# EAGLE design OSHWA Badges_7 (EAGLE 7.7.0)
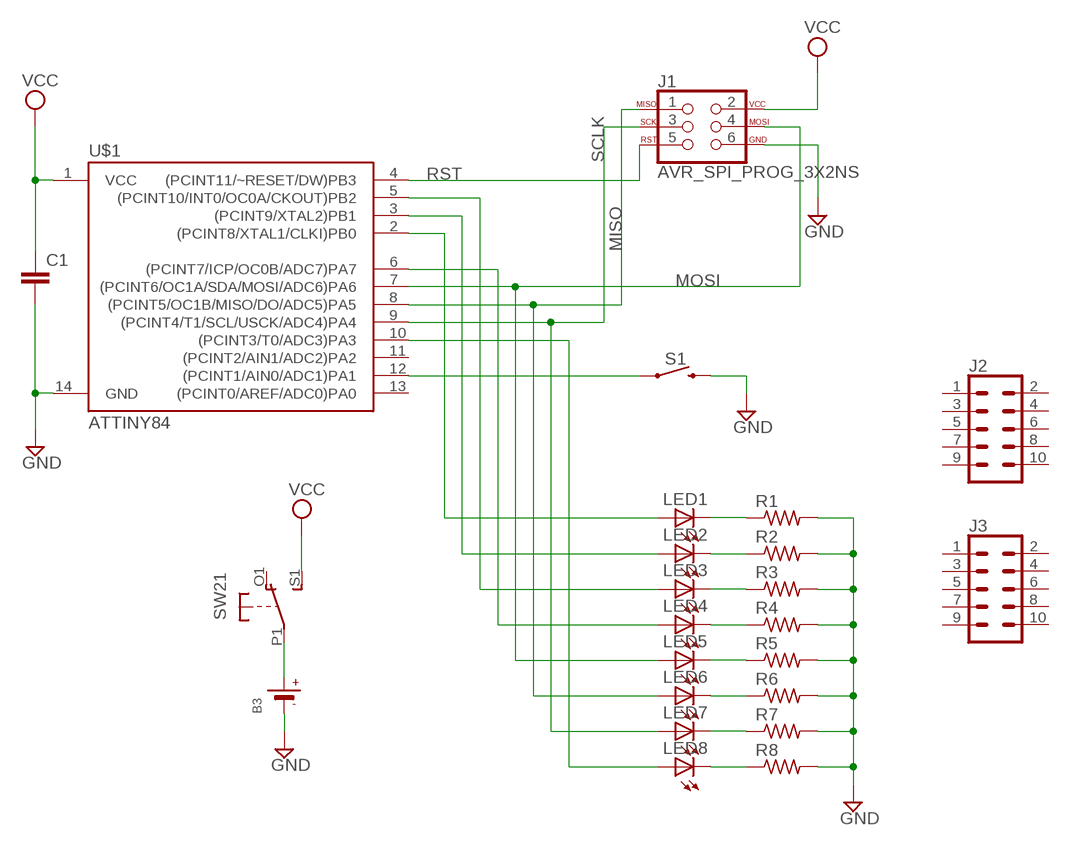
[diagram p0: schematic, sheet 1]

## Parts
B3  BATTERYCR2032_BAT-HLD-001  [CR2032_SMT_BAT-HLD-001]
C1  C-EUC0805K  [C0805K]
J1  AVR_SPI_PROG_3X2NS  [2X3-NS]
J2  CONN_05X2NO_SILK  [2X5_NOSILK]
J3  CONN_05X2NO_SILK  [2X5_NOSILK]
LED1  LEDCHIPLED_0805  [CHIPLED_0805]
LED2  LEDCHIPLED_0805  [CHIPLED_0805]
LED3  LEDCHIPLED_0805  [CHIPLED_0805]
LED4  LEDCHIPLED_0805  [CHIPLED_0805]
LED5  LEDCHIPLED_0805  [CHIPLED_0805]
LED6  LEDCHIPLED_0805  [CHIPLED_0805]
LED7  LEDCHIPLED_0805  [CHIPLED_0805]
LED8  LEDCHIPLED_0805  [CHIPLED_0805]
R1  R-US_M0805  [M0805]
R2  R-US_M0805  [M0805]
R3  R-US_M0805  [M0805]
R4  R-US_M0805  [M0805]
R5  R-US_M0805  [M0805]
R6  R-US_M0805  [M0805]
R7  R-US_M0805  [M0805]
R8  R-US_M0805  [M0805]
S1  MOMENTARY-SWITCH-SPST-PTH-6.0MM-KIT  [TACTILE_SWITCH_PTH_6.0MM_KIT]
SW2  DPDT-EG1390  [EG1390]
U$1  ATTINY84  [SO14]

## Nets
GND: B3.- C1.2 J1.6 R1.2 R2.2 R3.2 R4.2 R5.2 R6.2 R7.2 R8.2 S1.3 U$1.14(GND)
MISO: J1.1 LED6.A U$1.8((PCINT5/OC1B/MISO/DO/ADC5)PA5)
MOSI: J1.4 LED5.A U$1.7((PCINT6/OC1A/SDA/MOSI/ADC6)PA6)
N$3: LED1.C R1.1
N$6: LED2.C R2.1
N$7: LED3.C R3.1
N$8: LED4.C R4.1
N$9: LED5.C R5.1
N$10: LED6.C R6.1
N$11: LED7.C R7.1
N$12: LED8.C R8.1
N$13: LED1.A U$1.2((PCINT8/XTAL1/CLKI)PB0)
N$14: LED2.A U$1.3((PCINT9/XTAL2)PB1)
N$15: LED3.A U$1.5((PCINT10/INT0/OC0A/CKOUT)PB2)
N$16: LED4.A U$1.6((PCINT7/ICP/OC0B/ADC7)PA7)
N$17: LED8.A U$1.10((PCINT3/T0/ADC3)PA3)
N$19: B3.+$1(+) B3.+$2(+) SW2.P1(1:P)
N$23: S1.1 U$1.12((PCINT1/AIN0/ADC1)PA1)
RST: J1.5 U$1.4((PCINT11/~RESET/DW)PB3)
SCLK: J1.3 LED7.A U$1.9((PCINT4/T1/SCL/USCK/ADC4)PA4)
VCC: C1.1 J1.2 SW2.S1(1:S) U$1.1(VCC)
Unconnected: J2.1 J2.2 J2.3 J2.4 J2.5 J2.6 J2.7 J2.8 J2.9 J2.10 J3.1 J3.2 J3.3 J3.4 J3.5 J3.6 J3.7 J3.8 J3.9 J3.10 SW2.O1(1:O) SW2.O2(2:O) SW2.P2(2:P) SW2.S2(2:S) U$1.11((PCINT2/AIN1/ADC2)PA2) U$1.13((PCINT0/AREF/ADC0)PA0)

## Library data of the parts
B3 = microbuilder:BATTERY: CR1220 SMT - Digikey: 3001K-ND CD2032 BAT-HLD-001 - Digikey: BAT-HLD-001-ND
C1 = rcl:C-EU: CAPACITOR, European symbol
J1 = SparkFun-Connectors:AVR_SPI_PROG_3X2: AVR ISP 6 Pin This is the reduced ISP connector for AVR programming. Common on Arduino. This footprint will take up less PCB space and can be used with a 10-pin to 6-pin adapter such as SKU: BOB-08508 **Special note about "TEST_POINT" package. The stop mask is on the top side, so if you want your programming test points to be on the bottom of your board, make sure to place this package on the bottom side of the board. This also ensure that the orientation to program from the bottom side will be correct. SparkFun Products: SparkFun ISP Pogo Adapter <https://www.sparkfun.com/products/11591> - NS Tiny AVR Programmer <https://www.sparkfun.com/products/11801> -PTH
J2 J3 = SparkFun-Connectors:CONN_05X2: Multi connection point. Often used as Generic Header-pin footprint for 0.1 inch spaced/style header connections For AVR SPI programming port, see special device with nice symbol: "AVR_SPI_PROG_5x2.dev" You can populate with any combo of single row headers, but if you'd like an exact match, check these: 2x5 AVR ICSP Male Header <https://www.sparkfun.com/products/778> (PRT-00778) 2x5 Pin Shrouded Header <https://www.sparkfun.com/products/8506> (PRT-08506) On any of the 0.1 inch spaced packages, you can populate with these: Break Away Headers - Straight <https://www.sparkfun.com/products/116> (PRT-00116) Break Away Male Headers - Right Angle <https://www.sparkfun.com/products/553> (PRT-00553) Female Headers <https://www.sparkfun.com/products/115> (PRT-00115) Break Away Headers - Machine Pin <https://www.sparkfun.com/products/117> (PRT-00117) Break Away Female Headers - Swiss Machine Pin <https://www.sparkfun.com/products/743> (PRT-00743) Special note: the shrouded connector mates well with our 5x2 ribbon cables: 2x5 Pin IDC Ribbon Cable <https://www.sparkfun.com/products/8535> (PRT-08535)
LED1-LED8 = adafruit:LED: LED OSRAM: - CHIPLED LG R971, LG N971, LY N971, LG Q971, LY Q971, LO R971, LY R971 LH N974, LH R974 LS Q976, LO Q976, LY Q976 LO Q996 - Hyper CHIPLED LW Q18S LB Q993, LB Q99A, LB R99A - SideLED LS A670, LO A670, LY A670, LG A670, LP A670 LB A673, LV A673, LT A673, LW A673 LH A674 LY A675 LS A676, LA A676, LO A676, LY A676, LW A676 LS A679, LY A679, LG A679 - Hyper Micro SIDELED® LS Y876, LA Y876, LO Y876, LY Y876 LT Y87S - SmartLED LW L88C, LW L88S LB L89C, LB L89S, LG L890 LS L89K, LO L89K, LY L89K LS L896, LA L896, LO L896, LY L896 - TOPLED LS T670, LO T670, LY T670, LG T670, LP T670 LSG T670, LSP T670, LSY T670, LOP T670, LYG T670 LG T671, LOG T671, LSG T671 LB T673, LV T673, LT T673, LW T673 LH T674 LS T676, LA T676, LO T676, LY T676, LB T676, LH T676, LSB T676, LW T676 LB T67C, LV T67C, LT T67C, LS T67K, LO T67K, LY T67K, LW E67C LS E67B, LA E67B, LO E67B, LY E67B, LB E67C, LV E67C, LT E67C LW T67C LS T679, LY T679, LG T679 LS T770, LO T770, LY T770, LG T770, LP T770 LB T773, LV T773, LT T773, LW T773 LH T774 LS E675, LA E675, LY E675, LS T675 LS T776, LA T776, LO T776, LY T776, LB T776 LHGB T686 LT T68C, LB T68C - Hyper Mini TOPLED® LB M676 - Mini TOPLED Santana® LG M470 LS M47K, LO M47K, LY M47K Source: http://www.osram.convergy.de/
R1-R8 = rcl:R-US_: RESISTOR, American symbol
S1 = SparkFun-Switches:MOMENTARY-SWITCH-SPST: Momentary Switch (Pushbutton) - SPST Normally-open (NO) SPST momentary switches (buttons, pushbuttons). Variants PTH-12MM - 12mm square, through-hole Momentary Pushbutton Switch - 12mm Square <https://www.sparkfun.com/products/9190> (COM-09190) PTH-6.0MM, PTH-6.0MM-KIT - 6.0mm square, through-hole Mini Pushbutton Switch <https://www.sparkfun.com/products/97> (COM-00097) KIT package intended for soldering kit's - only one side of pads' copper is exposed. PTH-RIGHT-ANGLE-KIT - Right-angle, through-hole Right Angle Tactile Button <https://www.sparkfun.com/products/10791> - Used on SparkFun BigTime Watch Kit <https://www.sparkfun.com/products/11734> SMD-12MM - 12mm square, surface-mount Tactile Button - SMD (12mm) <https://www.sparkfun.com/products/12993> (COM-12993) Used on SparkFun PicoBoard <https://www.sparkfun.com/products/11888> SMD-4.5MM - 4.5mm Square Trackball Switch Used on SparkFun Blackberry Trackballer Breakout <https://www.sparkfun.com/products/13169> SMD-4.6MMX2.8MM - 4.60mm x 2.80mm, surface mount Used on SparkFun SAMD21 Mini Breakout <https://www.sparkfun.com/products/13664> SMD-5.2MM, SMD-5.2-REDUNDANT - 5.2mm square, surface-mount Mini Pushbutton Switch - SMD <https://www.sparkfun.com/products/8720> (COM-08720) Used on Arduino Pro Mini <https://www.sparkfun.com/products/11114> REDUNDANT package connects both switch circuits together SMD-6.0X3.5MM - 6.0 x 3.5mm, surface mount Momentary Reset Switch SMD <https://www.sparkfun.com/products/8229> (COM-08229) SMD-6.2MM-TALL - 6.2mm square, surface mount Tactile Button - SMD (6mm) <https://www.sparkfun.com/products/12992> Used on SparkFun Digital Sandbox <https://www.sparkfun.com/products/12651> SMD-RIGHT-ANGLE - Right-angle, surface mount Used on SparkFun Block for Intel® Edison - Arduino <https://www.sparkfun.com/products/13036>; PROD_ID: SWCH-08441; SF_SKU: COM-00097
SW2 = adafruit:DPDT
U$1 = SparkFun-IC-Microcontroller:ATTINY84: Atmel 14-pin 2/4/8kB flash uC Datasheet <https://cdn.sparkfun.com/datasheets/Widgets/doc8006.pdf> SparkFun Products Tiny AVR Programmer <https://www.sparkfun.com/products/11801> (PGM-11801) SparkFun Servo Trigger - Continuous Rotation <https://www.sparkfun.com/products/13872> (WIG-13872) SparkFun Servo Trigger <https://www.sparkfun.com/products/13118> (WIG-13118); PROD_ID: IC-11285

## Board
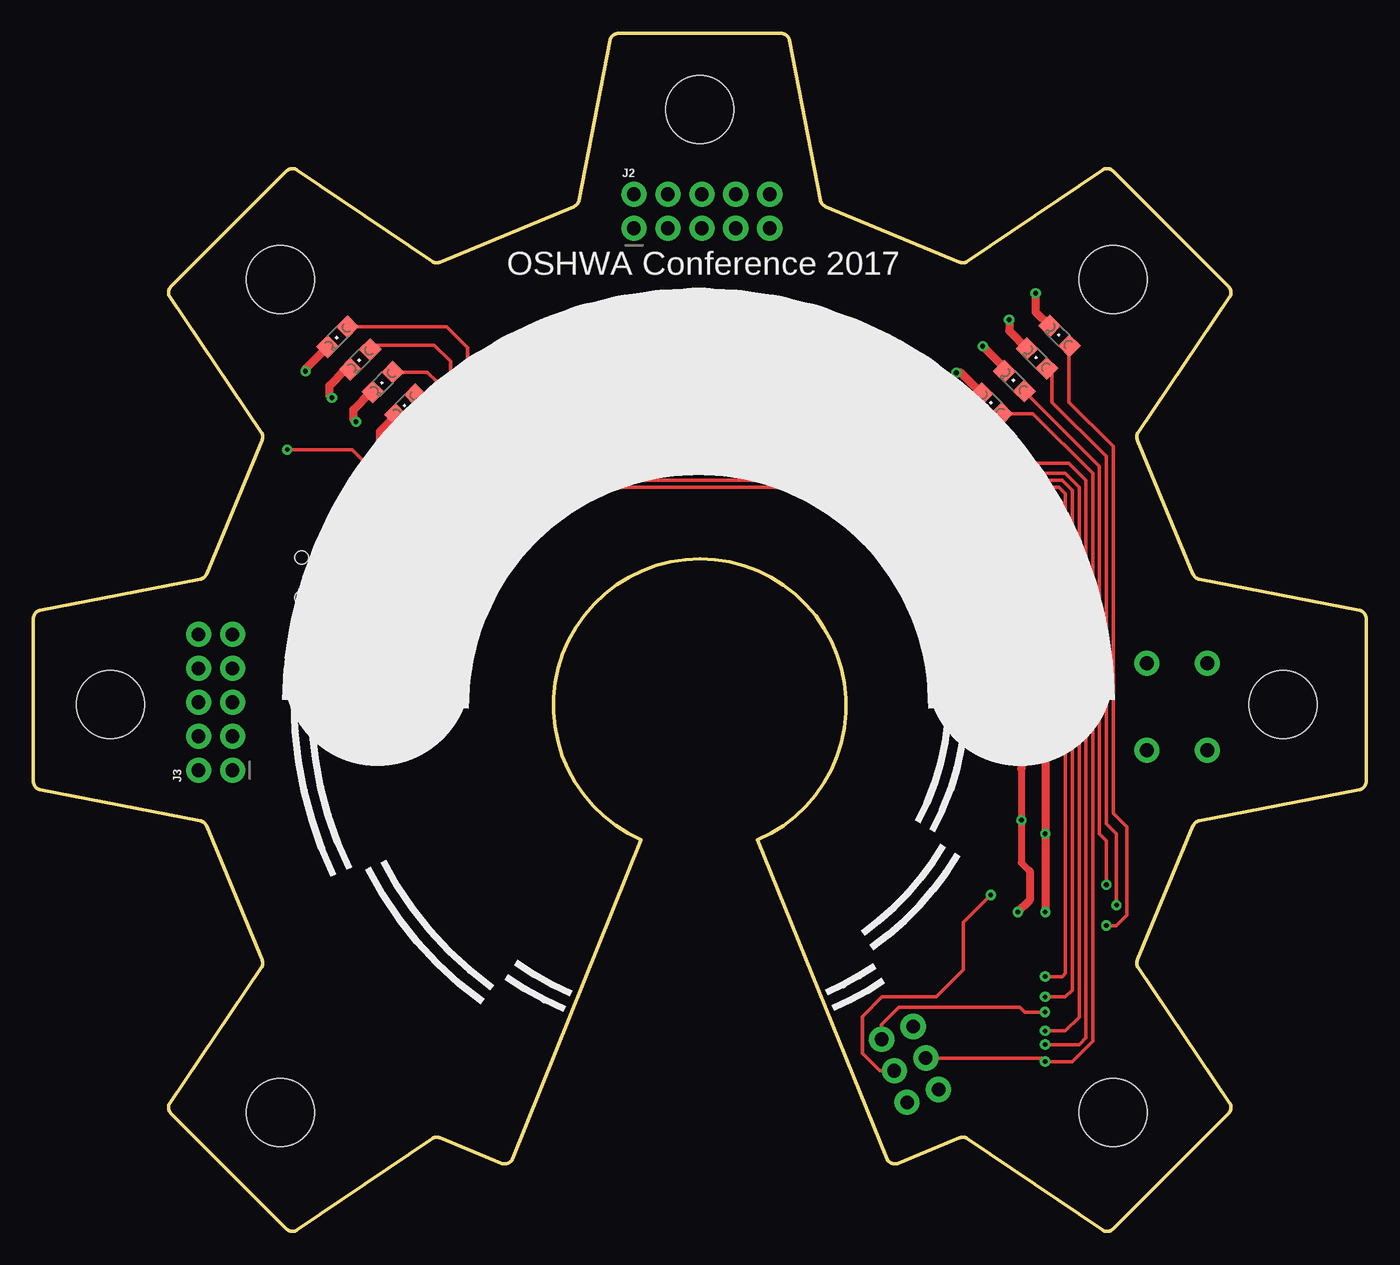
[diagram p1: board, top side]
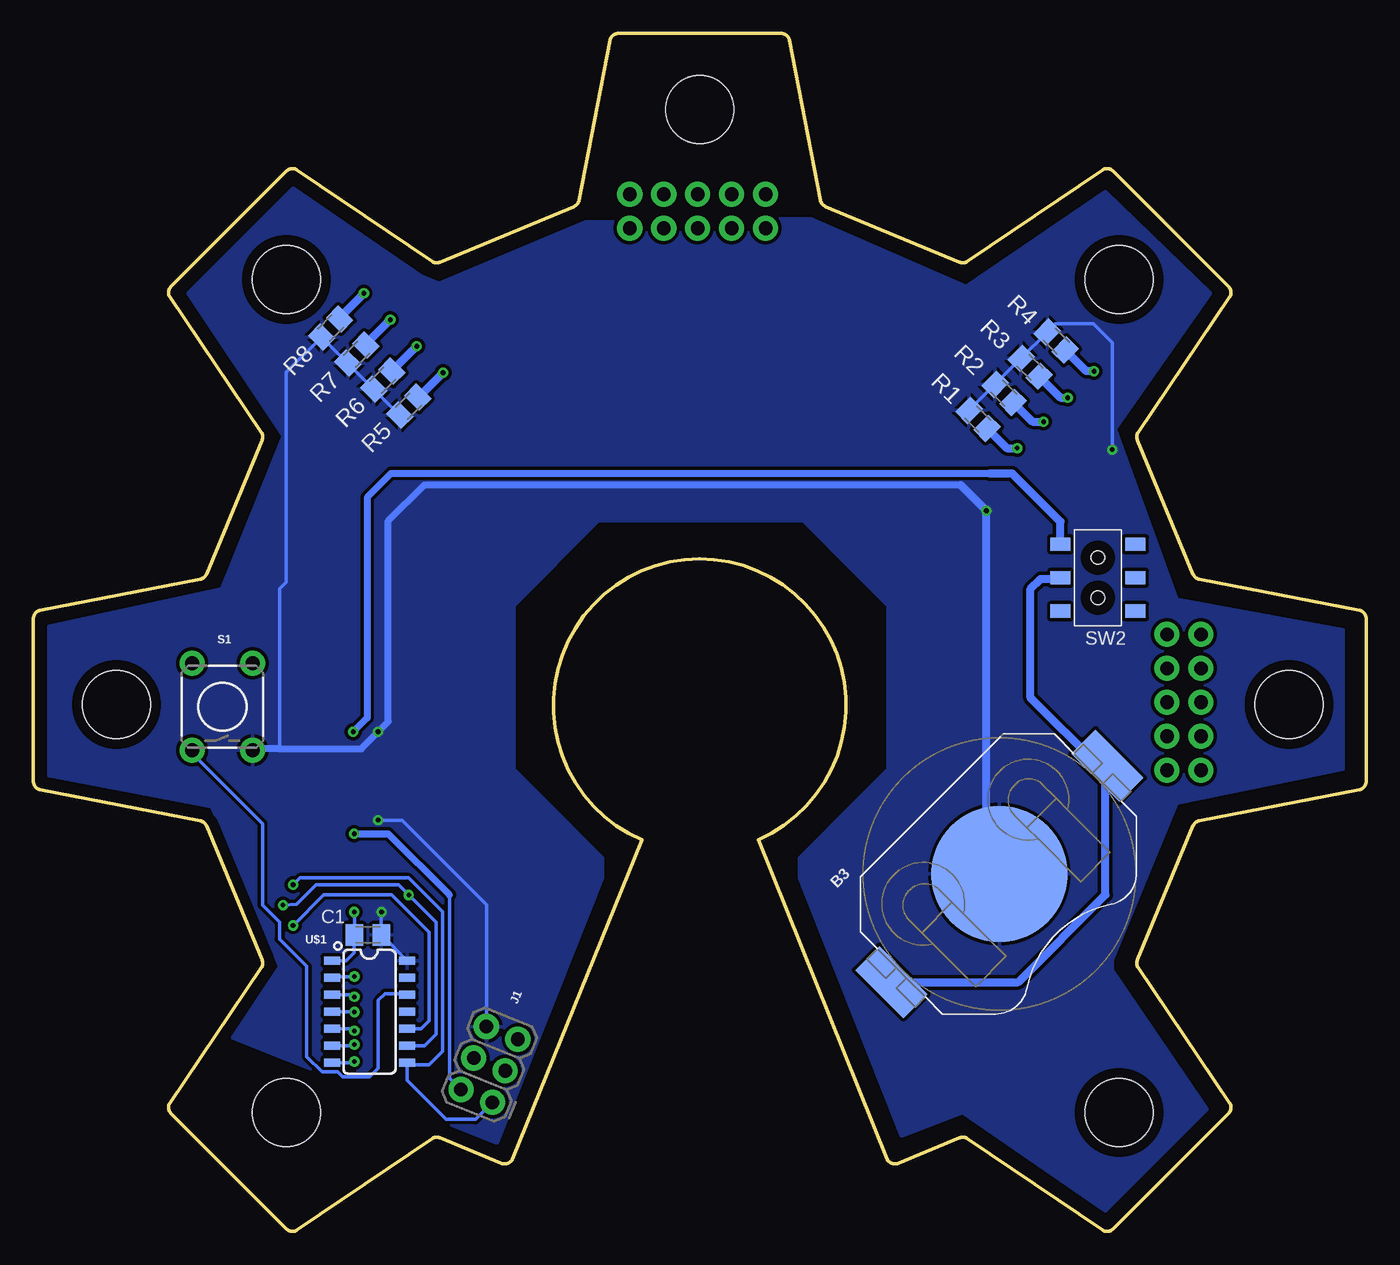
[diagram p2: board, bottom side, seen from below]

Size 99.6 x 89.51 mm. Coordinates in mm from the lower left corner, seen from the top.
Outline: 45.43,29.27 35.81,5.44 arc-90 34.97,5.09 30.39,6.99 arc57 29.78,6.93 19.71,0.11 arc-79 18.89,0.19 10.28,8.8 arc-79 10.2,9.61 17.02,19.69 arc57 17.08,20.29 12.94,30.3 arc57 12.47,30.68 0.52,32.99 arc-79 0,33.62 0,45.8 arc-79 0.52,46.43 12.47,48.73 arc57 12.94,49.12 17.08,59.12 arc57 17.02,59.73 10.2,69.8 arc-79 10.28,70.62 18.89,79.23 arc-79 19.71,79.31 29.78,72.49 arc57 30.39,72.43 40.39,76.57 arc57 40.78,77.04 43.08,88.99 arc-79 43.71,89.51 55.89,89.51 arc-79 56.52,88.99 58.83,77.04 arc57 59.21,76.57 69.22,72.43 arc57 69.82,72.49 79.9,79.31 arc-79 80.71,79.23 89.32,70.62 arc-79 89.4,69.8 82.58,59.73 arc57 82.52,59.12 86.67,49.12 arc57 87.14,48.73 99.08,46.43 arc-79 99.6,45.8 99.6,33.62 arc-79 99.08,32.99 87.14,30.68 arc57 86.67,30.3 82.52,20.29 arc57 82.58,19.69 89.4,9.61 arc-79 89.32,8.8 80.71,0.19 arc-79 79.9,0.11 69.82,6.93 arc57 69.22,6.99 64.63,5.09 arc-90 63.79,5.44 54.13,29.25 arc313 45.43,29.27
Copper layers (1*16): Top 0.035mm / dielectric 1.5mm / Bottom 0.035mm
Design rules "default *": minimum track width 6mil, minimum drill 0.35mm, track to track 10mil, track to pad 10mil, pad to pad 10mil, via to via 10mil, smd to smd 6mil, copper to edge 30mil, drill to drill 6mil, minimum pad ring 10mil, minimum via ring 8mil, stop-mask expansion 4mil, vias tented up to drill 0mil, thermal gap 10mil
Holes 5.08 mm at 18.47,8.89 5.77,39.37 18.47,71.12 49.8,83.82 80.7,71.12 93.4,39.37 80.7,8.89

### Footprints (pad centres in the part's own frame; a part is rotated, then mirrored left to right if it is on the bottom)
CR2032_SMT_BAT-HLD-001 = smd 2.54 x 5.08: +$1 -11.43,0; +$2 11.43,0 | smd 10.16 x 10.16: - 0,0
C0805K = smd 1.3 x 1.6: 1 -1,0; 2 1,0
2X3-NS = drill 1.016 pad 1.88: 1 -2.54,-1.27; 2 -2.54,1.27; 3 0,-1.27; 4 0,1.27; 5 2.54,-1.27; 6 2.54,1.27
2X5_NOSILK = drill 1.016 pad 1.88: 1 0,0; 2 0,2.54; 3 2.54,0; 4 2.54,2.54; 5 5.08,0; 6 5.08,2.54; 7 7.62,0; 8 7.62,2.54; 9 10.16,0; 10 10.16,2.54
CHIPLED_0805 = smd 1.2 x 1.2: A 0,-1.05; C 0,1.05
M0805 = smd 1.3 x 1.6: 1 -0.95,0; 2 0.95,0
TACTILE_SWITCH_PTH_6.0MM_KIT = drill 1.016 pad 1.88: 1 -3.251,2.261; 2 3.251,2.261; 3 -3.251,-2.261; 4 3.251,-2.261
EG1390 = smd 1 x 1.5: O1 -2.5,2.8; O2 -2.5,-2.8; P1 0,2.8; P2 0,-2.8; S1 2.5,2.8; S2 2.5,-2.8 | hole 1: 1.5,0; -1.5,0
SO14 = smd 0.6 x 1.2: 1 -3.175,-2.8; 2 -1.905,-2.8; 3 -0.635,-2.8; 4 0.635,-2.8; 5 1.905,-2.8; 6 3.175,-2.8; 7 4.445,-2.8; 8 4.445,2.8; 9 3.175,2.8; 10 1.905,2.8; 11 0.635,2.8; 12 -0.635,2.8; 13 -1.905,2.8; 14 -3.175,2.8

### Placement (x,y rotation side)
B3  27.41,26.71 45 bottom
C1  74.61,22.15 0 bottom
J1  65.52,12.48 68 bottom
J2  44.88,74.96 0 top
J3  14.88,34.46 90 top
LED1  27.8,61.78 135 top
LED2  26.11,63.47 135 top
LED3  24.42,65.16 135 top
LED4  22.73,66.85 135 top
LED5  71.63,61.84 45 top
LED6  73.32,63.53 45 top
LED7  75.01,65.22 45 top
LED8  76.7,66.91 45 top
R1  29,60.68 135 bottom
R2  27.06,62.62 135 bottom
R3  25.11,64.57 135 bottom
R4  23.16,66.52 135 bottom
R5  71.55,61.66 225 bottom
R6  73.5,63.61 225 bottom
R7  75.44,65.56 225 bottom
R8  77.39,67.5 225 bottom
S1  85.48,39.2 90 bottom
SW2  20.04,48.85 90 bottom
U$1  74.48,17.06 270 bottom

### Tracks (layer width: path | path; a pad name or v marks a point on that pad's centre or on a via)
GND  (via drill 0.35)
  Top 0.254: v18.98,58.42 23.8,58.42 v28.37,53.84
  Top 0.508: 73.84,34.54 v73.84,30.73 73.84,27.56 74.47,26.92
  Top 0.61: 74.47,26.92 74.47,24.76 v73.59,23.87 | v73.84,37.33 73.84,34.54
  Bottom 0.254: U$1.14 C1.2 73.61,23.85 v73.59,23.87 | R5.2 R6.2 R7.2 R8.2 80.7,64.19 80.7,48.51 81.21,48 81.21,36.06 | R1.2 R2.2 | R2.2 | R3.2 R2.2 | R3.2 | R3.2 R4.2 23.21,67.81 20.37,67.81 18.98,66.42 v18.98,58.42 | J1.6 65.75,24.42 72.06,30.73 v73.84,30.73
  Bottom 0.508: 30.3,55.77 70.39,55.77 73.08,53.08 73.08,38.1 v73.84,37.33 75.11,36.06 81.21,36.06 83.11,36.06 S1.3
  Bottom 0.61: B3.- 28.37,27.68 v28.37,53.84 30.3,55.77
  pour Bottom: 34.72,7.11 42.34,26.41 42.34,27.94 35.74,34.54 35.74,46.73 42.09,53.08 57.35,53.08 63.68,46.76 63.68,34.54 57.08,27.94 57.08,26.41 64.95,6.6 84.76,14.47 81.21,19.81 86.29,31.75 98.48,34.03 98.48,45.21 85.52,48 80.95,59.43 88.06,70.1 80.19,77.97 70.54,71.37 69.27,70.86 58.35,75.43 41.58,75.69 29.9,70.61 19.48,77.72 11.61,70.1 18.72,59.94 14.14,47.24 1.7,44.95 1.7,34.54 14.15,32 18.98,20.32 18.98,19.55 11.86,9.14 19.48,1.52 30.15,8.89
MISO  (via drill 0.35)
  Top 0.254: v80.19,25.9 80.19,29.21 79.68,29.71 79.68,57.17 LED6.A
  Bottom 0.254: J1.1 66.57,8.38 68.76,8.38 71.68,11.3 U$1.8 71.51,12.44 70.03,12.44 69.01,13.46 69.01,23.87 71.55,26.41 79.68,26.41 v80.19,25.9
MOSI  (via drill 0.35)
  Top 0.254: v75.62,12.7 75.36,12.96 J1.4 75.61,12.96 75.87,12.7 77.65,12.7 79.17,14.22 79.17,56.64 74.71,61.1 LED5.A
  Bottom 0.254: v75.62,12.7 75.7,12.61 U$1.7
N$3  (via drill 0.35)
  Top 0.61: v26.08,58.53 25.9,58.71 25.9,59.78 27.06,60.94 LED1.C
  Bottom 0.61: R1.1 26.85,58.53 v26.08,58.53
N$6  (via drill 0.35)
  Top 0.61: v24.1,60.5 23.92,60.68 23.92,61.4 25.25,62.73 LED2.C
  Bottom 0.61: R2.1 24.93,60.5 v24.1,60.5
N$7  (via drill 0.35)
  Top 0.61: v22.31,62.3 22.13,62.48 22.13,63.2 23.35,64.42 LED3.C
  Bottom 0.61: R3.1 22.84,62.3 v22.31,62.3
N$8  (via drill 0.35)
  Top 0.61: LED4.C 20.33,64.45 v20.33,64.27
  Bottom 0.61: v20.33,64.27 20.92,64.27 R4.1
N$9  (via drill 0.35)
  Top 0.61: v68.98,64.17 69.3,64.17 LED5.C
  Bottom 0.61: R5.1 70.81,62.34 v68.98,64.17
N$10  (via drill 0.35)
  Top 0.61: LED6.C 72.58,64.52 v70.96,66.14
  Bottom 0.61: v70.96,66.14 v70.97,66.14 R6.1
N$11  (via drill 0.35)
  Top 0.61: v72.93,68.12 72.93,67.3 LED7.C
  Bottom 0.61: R7.1 74.77,66.28 v72.93,68.12
N$12  (via drill 0.35)
  Top 0.61: v74.91,70.09 74.91,68.7 LED8.C
  Bottom 0.61: R8.1 76.72,68.28 v74.91,70.09
N$13  (via drill 0.35)
  Top 0.254: 77.14,36.57 77.14,37.33 | 77.14,37.33 77.14,55.11 76.63,55.62 31.42,55.62 28.54,58.5 LED1.A | v75.62,19.05 76.89,19.05 77.14,19.3 77.14,35.81 | 77.14,35.81 77.14,36.83 | 77.14,37.33 77.14,35.81
  Bottom 0.254: v75.62,19.05 77.19,19.05 U$1.2
N$14  (via drill 0.35)
  Top 0.254: v75.62,17.52 77.14,17.52 77.65,18.03 77.65,55.37 76.89,56.13 33.2,56.13 30.15,59.18 30.15,63.5 29.44,64.21 LED2.A
  Bottom 0.254: v75.62,17.52 75.79,17.69 U$1.3
N$15  (via drill 0.35)
  Top 0.254: LED3.A 25.16,66.23 29.96,66.23 31.17,65.02 31.17,59.94 34.47,56.64 77.14,56.64 78.16,55.62 78.16,16 77.14,14.98 v75.62,14.98
  Bottom 0.254: v75.62,14.98 75.79,15.15 U$1.5
N$16  (via drill 0.35)
  Top 0.254: LED4.A 23.8,67.59 30.89,67.59 32.44,66.04 32.44,60.96 35.99,57.4 77.4,57.4 78.67,56.13 78.67,14.47 78.16,13.97 v75.62,13.97
  Bottom 0.254: v75.62,13.97 75.7,13.88 U$1.6
N$17  (via drill 0.35)
  Top 0.254: LED8.A 77.4,66.12 77.4,61.97 80.7,58.67 80.7,31.24 81.71,30.23 81.71,23.62 80.95,22.86 v80.19,22.86
  Bottom 0.254: U$1.10 70.62,15.15 70.03,15.74 70.03,22.35 72.82,25.14 77.9,25.14 v80.19,22.86
N$19
  Bottom 0.61: SW2.P1 22.92,48.76 24.31,48.76 25.07,48 25.07,39.87 19.99,34.79 B3.+$2 19.48,34.63 19.48,25.14 26,18.63 B3.+$1
N$23
  Bottom 0.254: U$1.12 71.76,17.78 73.33,17.78 73.84,17.27 73.84,12.19 74.47,11.55 76.51,11.55 76.88,11.93 78.04,11.93 79.17,13.07 79.17,19.81 81.21,21.84 81.21,23.11 82.48,24.38 82.48,30.48 87.74,35.74 S1.1
RST  (via drill 0.35)
  Top 0.254: v75.61,16.39 74.09,16.39 73.73,16.76 64.7,16.76 63.4,15.46 J1.5
  Bottom 0.254: U$1.4 75.66,16.42 75.65,16.43 v75.61,16.39
SCLK  (via drill 0.35)
  Top 0.254: 75.87,64.48 LED7.A 76.13,64.1 76.13,61.97 80.19,57.91 80.19,30.48 80.95,29.71 v80.95,24.38 | v71.55,25.14 69.52,23.11 69.52,19.55 67.49,17.52 63.43,17.52 61.95,16.04 61.95,13.33 63.27,12 J1.3
  Bottom 0.254: v80.95,24.38 79.92,24.46 78.48,25.9 72.32,25.9 v71.55,25.14 69.52,23.11 69.52,14.73 70.37,13.88 U$1.9
VCC  (via drill 0.35)
  Top 0.61: v75.63,23.87 v75.63,29.71 75.63,37.33 v75.7,37.33
  Bottom 0.254: 68.25,11.2 J1.2 68.51,11.45 68.51,25.14 | v75.63,23.87 75.61,23.85 C1.1 75.63,20.82 76.22,20.23 U$1.1
  Bottom 0.508: 28.12,56.64 72.86,56.64 74.65,54.84 74.65,38.38 v75.7,37.33 | v75.63,29.71 73.08,29.71 68.51,25.14
  Bottom 0.61: SW2.S1 22.84,53.03 26.45,56.64 28.12,56.64

### Text on the board
tPlace: OSHWA Conference 2017